# EAGLE design v1 (EAGLE 8.5.1)
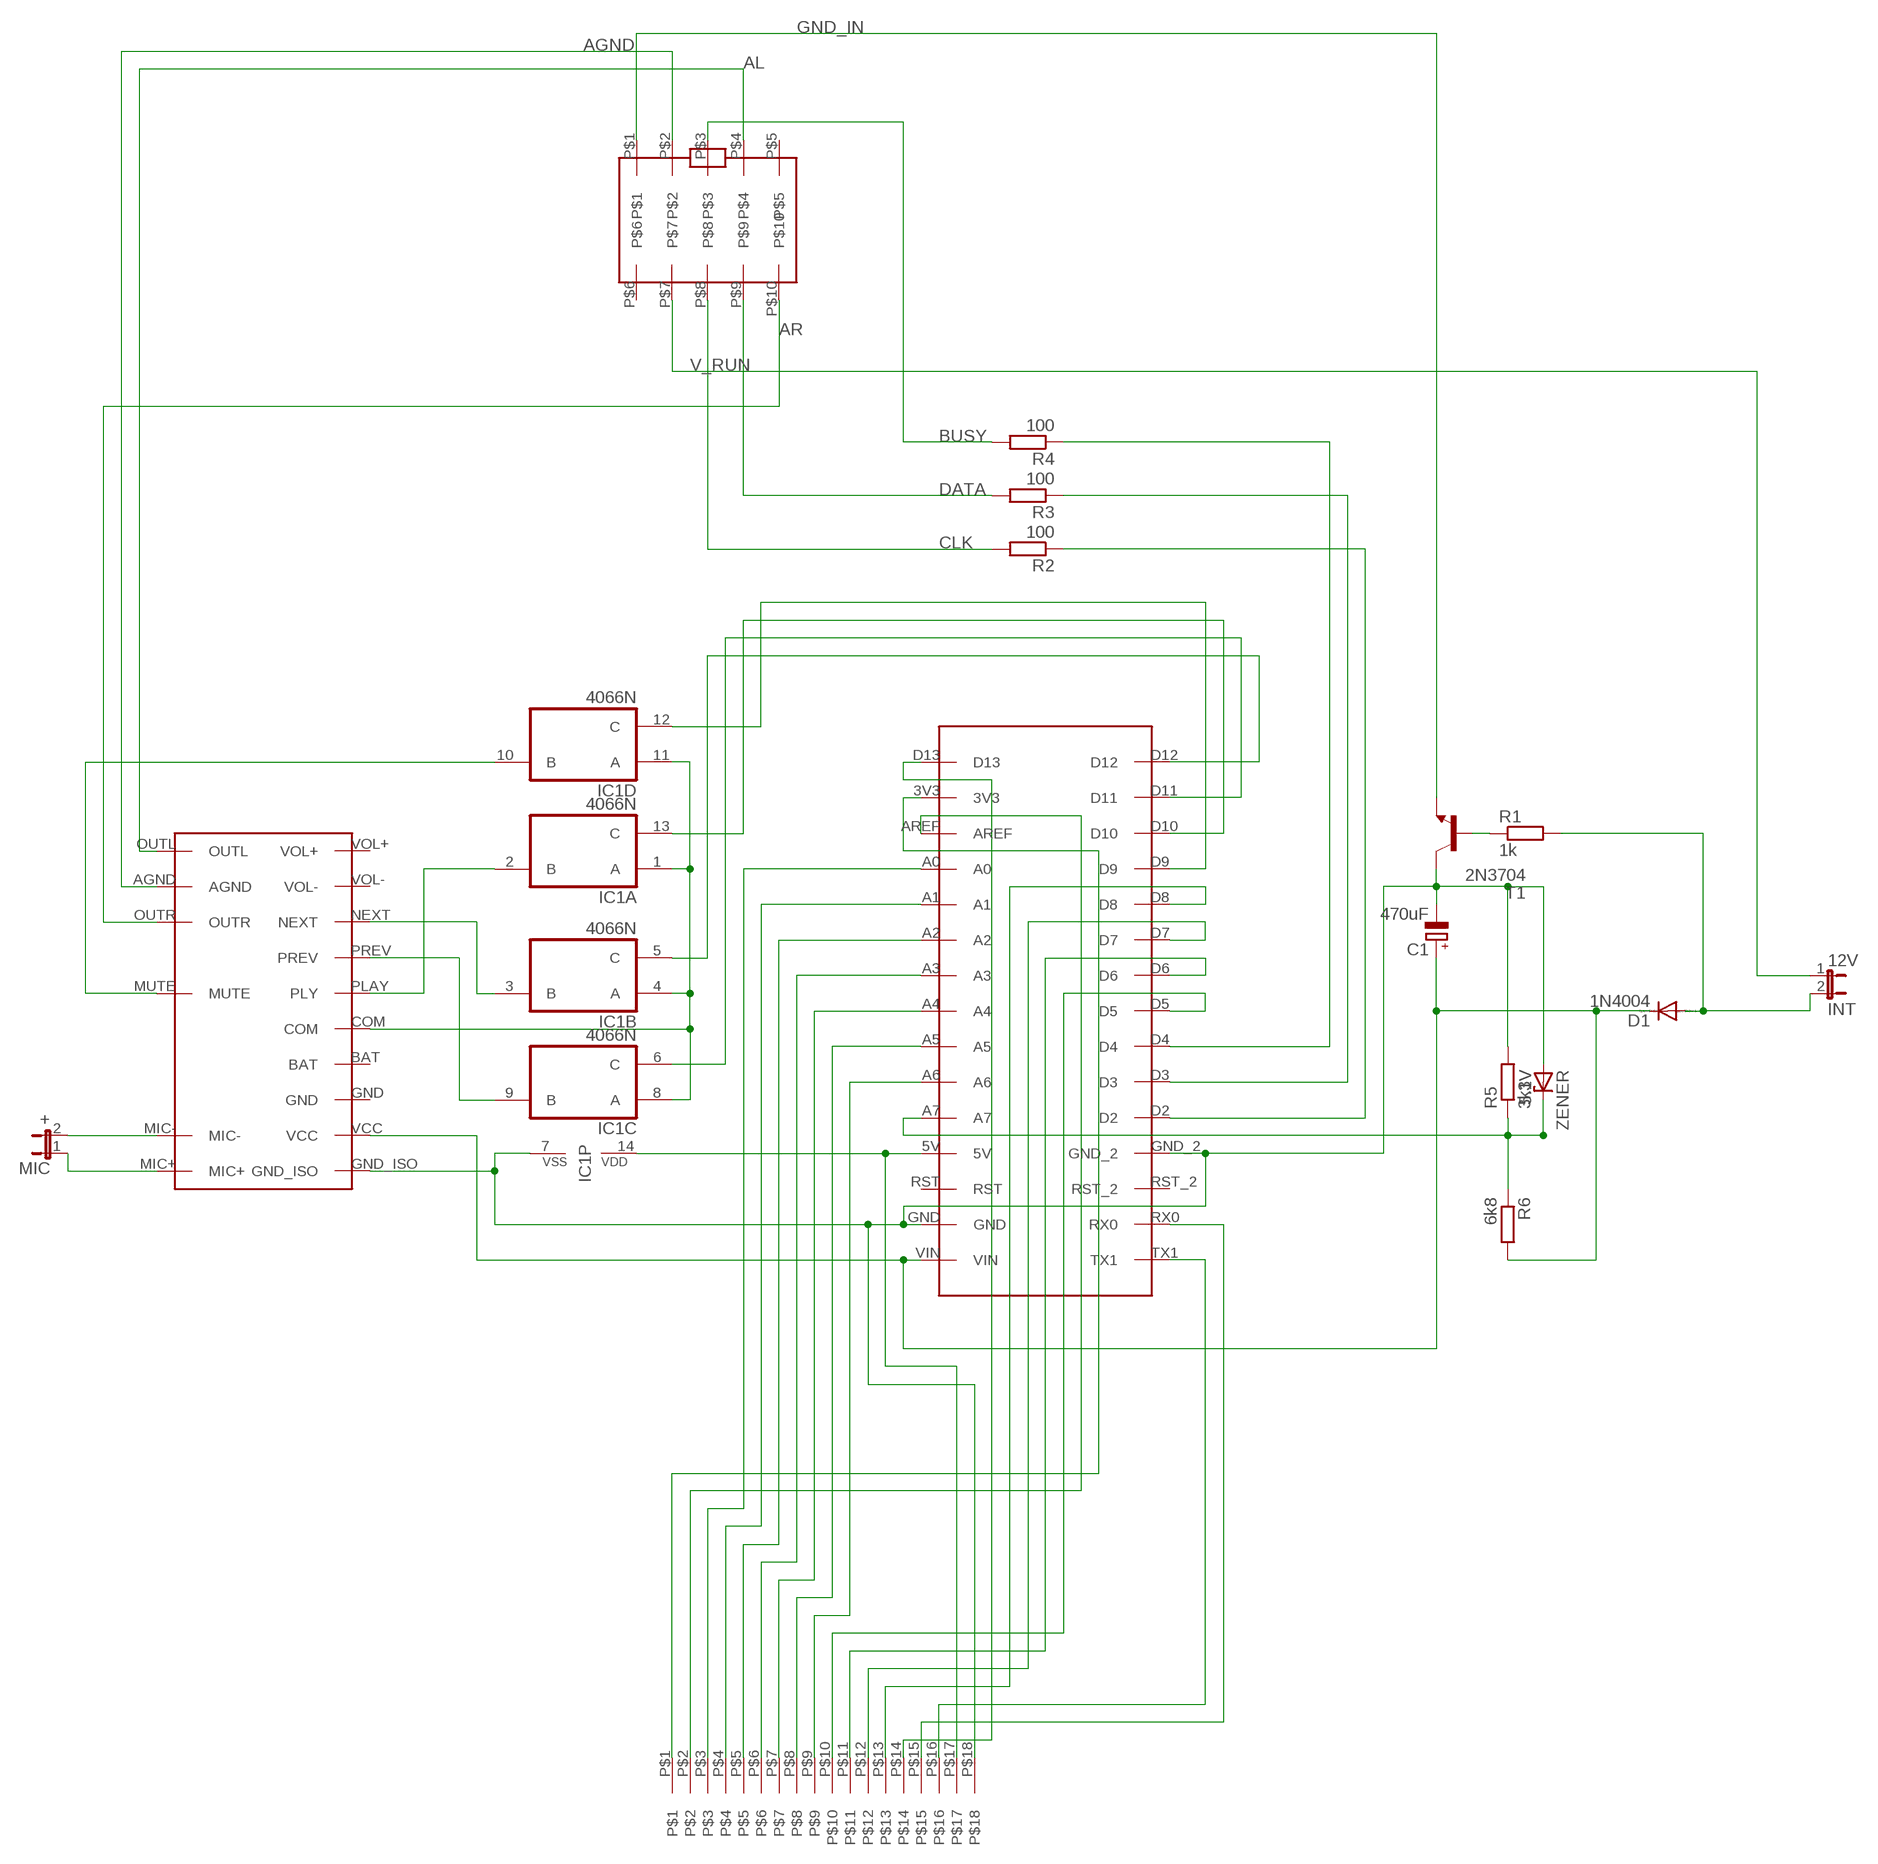
[diagram p0: schematic, sheet 1]

## Parts
12V  INT  JP1E  [JP1]
C1  470uF  CPOL-EUE3.5-8  [E3,5-8]
D1  1N4004  [DO41-10]
IC1  4066N  [DIL14]
MIC  +  JP1E  [JP1]
R1  1k  R-EU_0207/10  [0207/10]
R2  100  R-EU_0207/10  [0207/10]
R3  100  R-EU_0207/10  [0207/10]
R4  100  R-EU_0207/10  [0207/10]
R5  3k3  R-EU_0207/10  [0207/10]
R6  6k8  R-EU_0207/10  [0207/10]
T1  2N3704  [TO92]
U$1  JMP18X1  [JMP18X1]
U$2  CSR8645_MODULE  [CSR8645_MODULE]
U$4  2X5_PIN_SOCKET  [2X5_PIN_SOCKET]
U$5  ARDUINO_NANO  [ARDUINO_NANO]
ZENER  5.1V  ZENER-DIODEDO41Z10  [DO41Z10]

## Nets
12V: 12V.2 D1.A R1.2
AGND: U$2.AGND U$4.P$2
AL: U$2.OUTL U$4.P$4
AR: U$2.OUTR U$4.P$10
BUSY: R4.2 U$4.P$3
CLK: R2.2 U$4.P$8
DATA: R3.2 U$4.P$9
GND: C1.- IC1.7(P:VSS) R5.2 T1.2(C) U$1.P$18 U$2.GND_ISO U$5.GND U$5.GND_2 ZENER.A
GND_IN: T1.3(E) U$4.P$1
N$1: IC1.5(B:C) U$5.D12
N$2: IC1.6(C:C) U$5.D11
N$3: IC1.13(A:C) U$5.D10
N$4: IC1.12(D:C) U$5.D9
N$5: U$1.P$16 U$5.TX1
N$6: IC1.1(A:A) IC1.4(B:A) IC1.8(C:A) IC1.11(D:A) U$2.COM
N$7: R1.1 T1.1(B)
N$8: R5.1 R6.1 U$5.A7 ZENER.C
N$9: IC1.2(A:B) U$2.PLAY(PLY)
N$10: U$1.P$15 U$5.RX0
N$11: IC1.9(C:B) U$2.PREV
N$12: IC1.3(B:B) U$2.NEXT
N$13: R2.1 U$5.D2
N$14: IC1.14(P:VDD) U$1.P$17 U$5.5V
N$15: IC1.10(D:B) U$2.MUTE
N$16: R3.1 U$5.D3
N$17: R4.1 U$5.D4
N$18: U$1.P$14 U$5.D13
N$19: U$1.P$13 U$5.D8
N$20: U$1.P$12 U$5.D7
N$21: U$1.P$11 U$5.D6
N$22: U$1.P$10 U$5.D5
N$23: U$1.P$9 U$5.A6
N$24: U$1.P$8 U$5.A5
N$25: U$1.P$7 U$5.A4
N$26: U$1.P$6 U$5.A3
N$27: U$1.P$5 U$5.A2
N$28: U$1.P$4 U$5.A1
N$29: U$1.P$3 U$5.A0
N$30: U$1.P$2 U$5.AREF
N$31: U$1.P$1 U$5.3V3
N$32: MIC.1 U$2.MIC+
N$33: MIC.2 U$2.MIC-
V_RUN: 12V.1 U$4.P$7
VCC: C1.+ D1.C R6.2 U$2.VCC U$5.VIN
Unconnected: U$2.BAT U$2.GND U$2.VOL+ U$2.VOL- U$4.P$5 U$4.P$6 U$5.RST U$5.RST_2

## Library data of the parts
12V MIC = jumper:JP1E: JUMPER
C1 = rcl:CPOL-EU: POLARIZED CAPACITOR, European symbol; SPICEPREFIX: C
D1 = diode:1N4004: DIODE general purpose rectifier, 1 A
IC1 = 40xx:4066: Quad bilateral ANALOG SWITCH
R1-R6 = rcl:R-EU_: RESISTOR, European symbol; SPICEPREFIX: R
T1 = transistor:2N3704: NPN TRANSISTOR
U$1 = archi_laptop:JMP18X1
U$2 = archi_laptop:CSR8645_MODULE
U$4 = archi_laptop:2X5_PIN_SOCKET
U$5 = archi_laptop:ARDUINO_NANO
ZENER = diode:ZENER-DIODE: Z-Diode

## Board
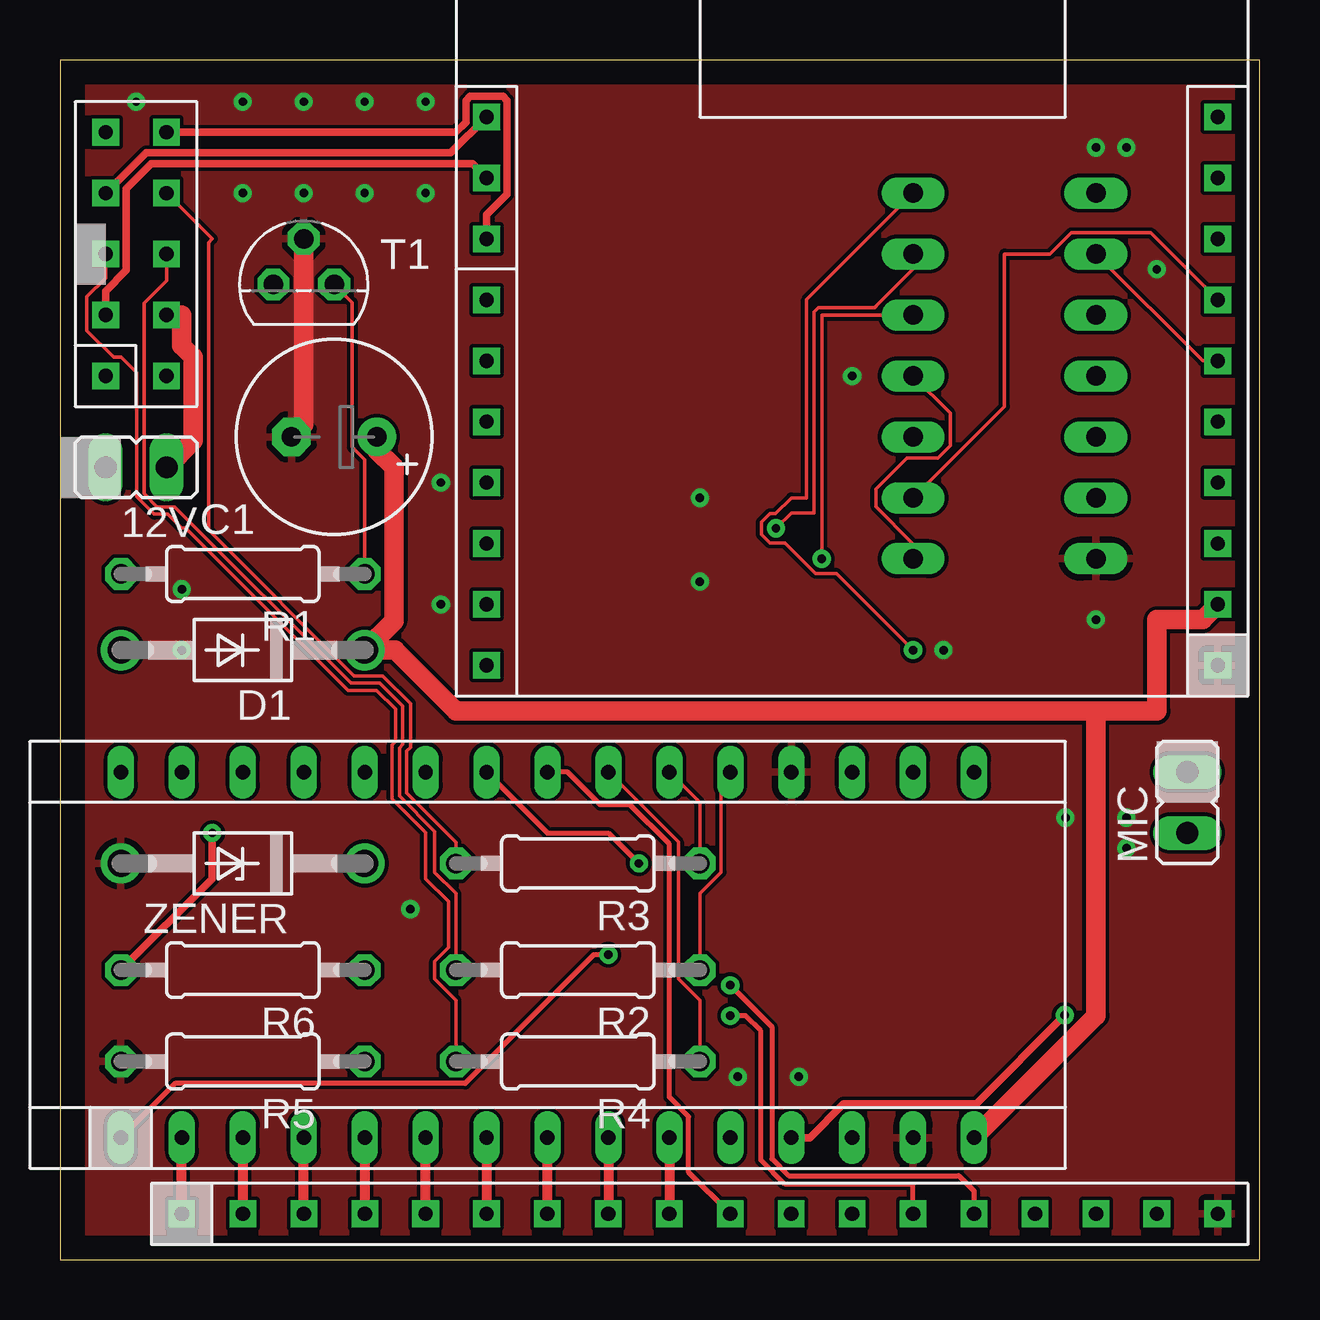
[diagram p1: board, top side]
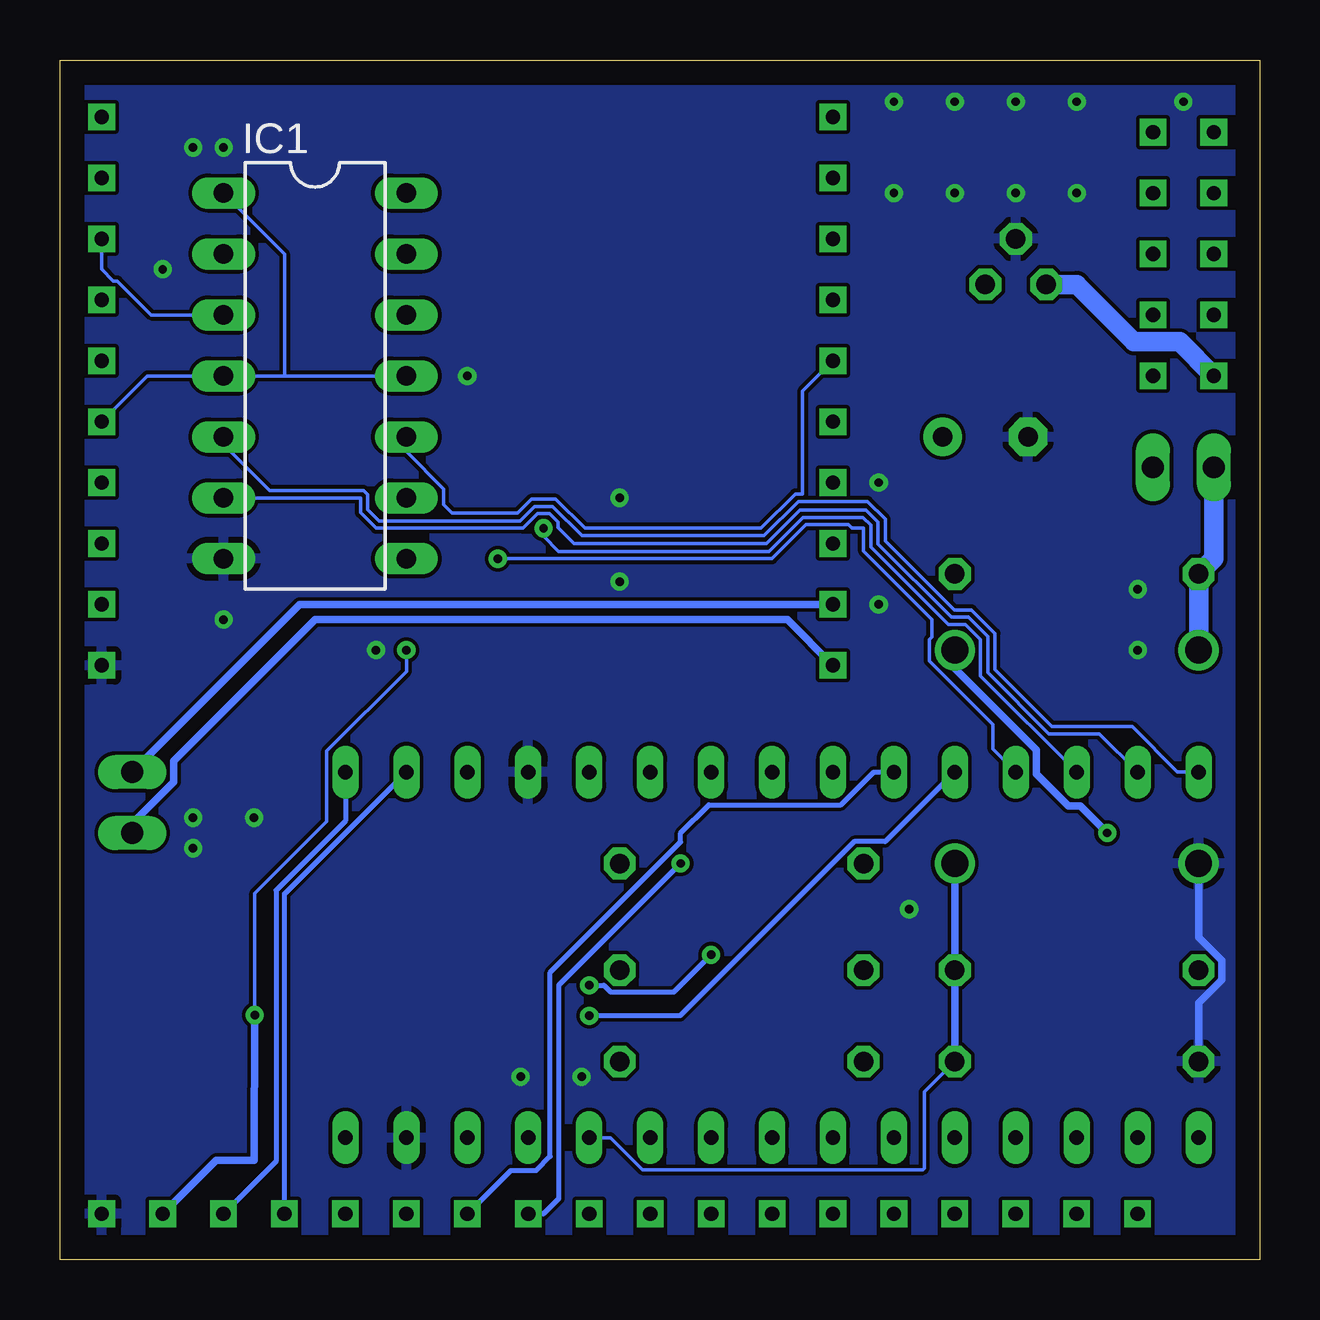
[diagram p2: board, bottom side, seen from below]

Size 50 x 50 mm. Coordinates in mm from the lower left corner, seen from the top.
Outline: 0,0 50,0 50,50 0,50 0,0
Copper layers (1*16): Top 0.035mm / dielectric 1.5mm / Bottom 0.035mm
Design rules "default *": minimum track width 6mil, minimum drill 0.35mm, track to track 6mil, track to pad 6mil, pad to pad 6mil, via to via 6mil, smd to smd 6mil, copper to edge 40mil, drill to drill 6mil, minimum pad ring 10mil, minimum via ring 8mil, stop-mask expansion 4mil, vias tented up to drill 0mil, thermal gap 10mil

### Footprints (pad centres in the part's own frame; a part is rotated, then mirrored left to right if it is on the bottom)
JP1 = drill 0.914 long: 1 0,-1.27; 2 0,1.27
E3,5-8 = drill 0.813 pad 1.6: + -1.778,0 | drill 0.813 pad 1.6 octagon: - 1.778,0
DO41-10 = drill 1.118: A 5.08,0; C -5.08,0
DIL14 = drill 0.813 long: 1 -7.62,-3.81; 2 -5.08,-3.81; 3 -2.54,-3.81; 4 0,-3.81; 5 2.54,-3.81; 6 5.08,-3.81; 7 7.62,-3.81; 8 7.62,3.81; 9 5.08,3.81; 10 2.54,3.81; 11 0,3.81; 12 -2.54,3.81; 13 -5.08,3.81; 14 -7.62,3.81
0207/10 = drill 0.813 octagon: 1 -5.08,0; 2 5.08,0
TO92 = drill 0.813 octagon: 1 1.27,0; 2 0,1.905; 3 -1.27,0
JMP18X1 = drill 0.6 square: P$1 0,12.7; P$2 0,10.16; P$3 0,7.62; P$4 0,5.08; P$5 0,2.54; P$6 0,0; P$7 0,-2.54; P$8 0,-5.08; P$9 0,-7.62; P$10 0,-10.16; P$11 0,-12.7; P$12 0,-15.24; P$13 0,-17.78; P$14 0,-20.32; P$15 0,-22.86; P$16 0,-25.4; P$17 0,-27.94; P$18 0,-30.48
CSR8645_MODULE = drill 0.6 square: AGND -15.24,5.08; BAT 15.24,-7.62; COM 15.24,-5.08; GND 15.24,-10.16; GND_ISO 15.24,-15.24; MIC+ -15.24,-15.24; MIC- -15.24,-12.7; MUTE -15.24,-2.54; NEXT 15.24,2.54; OUTL -15.24,7.62; OUTR -15.24,2.54; P$1 -15.24,0; P$2 -15.24,-5.08; P$3 -15.24,-7.62; P$4 -15.24,-10.16; PLAY 15.24,-2.54; PREV 15.24,0; VCC 15.24,-12.7; VOL+ 15.24,7.62; VOL- 15.24,5.08
2X5_PIN_SOCKET = drill 0.6 square: P$1 -5.08,2.54; P$2 -2.54,2.54; P$3 0,2.54; P$4 2.54,2.54; P$5 5.08,2.54; P$6 -5.08,0; P$7 -2.54,0; P$8 0,0; P$9 2.54,0; P$10 5.08,0
ARDUINO_NANO = drill 0.6 long: 3V3 -7.62,12.7; 5V -7.62,-12.7; A0 -7.62,7.62; A1 -7.62,5.08; A2 -7.62,2.54; A3 -7.62,0; A4 -7.62,-2.54; A5 -7.62,-5.08; A6 -7.62,-7.62; A7 -7.62,-10.16; AREF -7.62,10.16; D2 7.62,-10.16; D3 7.62,-7.62; D4 7.62,-5.08; D5 7.62,-2.54; D6 7.62,0; D7 7.62,2.54; D8 7.62,5.08; D9 7.62,7.62; D10 7.62,10.16; D11 7.62,12.7; D12 7.62,15.24; D13 -7.62,15.24; GND -7.62,-17.78; GND_2 7.62,-12.7; RST -7.62,-15.24; RST_2 7.62,-15.24; RX0 7.62,-17.78; TX1 7.62,-20.32; VIN -7.62,-20.32
DO41Z10 = drill 1.118: A 5.08,0; C -5.08,0

### Placement (x,y rotation side)
12V  3.17,33.02 90 top
C1  11.43,34.29 180 top
D1  7.62,25.4 180 top
IC1  39.37,36.83 270 bottom
MIC  46.99,19.05 0 top
R1  7.62,28.57 180 top
R2  21.59,12.06 180 top
R3  21.59,16.51 180 top
R4  21.59,8.26 180 top
R5  7.62,8.26 180 top
R6  7.62,12.06 180 top
T1  10.16,40.64 0 top
U$1  17.78,1.91 90 top
U$2  33.02,40.01 0 top
U$4  4.45,41.91 90 top
U$5  17.78,12.7 90 top
ZENER  7.62,16.51 180 top

### Tracks (layer width: path | path; a pad name or v marks a point on that pad's centre or on a via)
12V
  Bottom 0.813: 12V.2 1.91,29.21 R1.2 D1.A
AGND
  Top 0.305: U$4.P$2 1.91,40.37 2.76,41.23 2.76,44.63 3.81,45.67 17.19,45.67 U$2.AGND
AL
  Top 0.305: U$4.P$4 3.59,46.13 16.29,46.13 U$2.OUTL
AR
  Top 0.305: 5.34,46.99 U$4.P$10 16.5,46.99 16.92,47.41 16.92,48.3 17.1,48.48 18.46,48.48 18.64,48.3 18.64,44.41 17.78,43.55 U$2.OUTR
BUSY
  Top 0.152: U$4.P$3 1.91,40.91 1.12,40.13 1.12,38.72 2.23,37.61 2.55,37.61 3.2,36.97 3.2,31.79 3.93,31.06 4.5,31.06 5.08,30.48 5.25,30.48 12.01,23.72 13.2,23.72 13.98,22.94 13.98,21.59 13.85,21.45 13.85,19.19 15.24,17.8 15.24,15.88 16.19,14.92 16.19,13.01 15.62,12.43 15.62,11.7 16.51,10.81 R4.2
CLK
  Top 0.152: U$4.P$8 4.45,40.8 3.5,39.86 3.5,31.92 4.06,31.37 4.79,31.37 12.13,24.03 13.32,24.03 14.29,23.06 14.29,21.46 14.15,21.32 14.15,19.32 15.62,17.85 15.62,16.14 16.51,15.25 R2.2
DATA
  Top 0.152: U$4.P$9 6.35,42.55 6.19,42.39 6.19,30.4 12.26,24.33 13.45,24.33 14.61,23.18 14.61,21.35 14.46,21.2 14.46,19.44 16.51,17.39 R3.2
GND  (via drill 0.35)
  Top 0.813: C1.- 10.16,34.8 T1.2
  Bottom 0.305: R5.2 2.54,10.7 1.57,11.66 1.57,12.46 2.54,13.43 ZENER.A
  other vias: 7.62,48.26 10.16,48.26 7.62,44.45 10.16,44.45 12.7,44.45 15.24,44.45 12.7,48.26 15.24,48.26 3.17,48.26 15.88,27.3 28.26,7.62 14.61,14.61 30.8,7.62 43.18,46.35 44.45,46.35 41.91,18.41 45.72,41.27 44.45,18.41 44.45,17.14 26.67,28.26 15.88,32.38 33.02,36.83 36.83,25.4 26.67,31.75 43.18,26.67 5.08,25.4 5.08,27.94
  pour Bottom: -1.27,52.07 50.8,50.8 50.8,-1.27 -1.27,-1.27
  pour Top: -2.54,52.7 54.61,52.7 55.88,-2.54 54.61,-3.81 -3.81,-3.81 -5.08,-2.54 -5.08,52.07
GND_IN
  Bottom 0.813: U$4.P$1 3.33,38.26 5.23,38.26 7.61,40.64 T1.3
N$1
  Bottom 0.152: IC1.5 43.18,33.97 41.26,32.05 37.35,32.05 37.17,31.88 37.17,31.25 36.7,30.79 30.83,30.79 30.22,31.39 29.47,31.39 28.25,30.17 20.65,30.17 19.22,31.6 16.34,31.6 15.6,30.86 15.6,29.95 12.72,27.08 12.01,27.08 11.02,26.09 11.02,24.59 8.65,22.21 5.31,22.21 3.42,20.32 U$5.D12
N$2
  Bottom 0.152: IC1.6 37.48,31.75 37.48,31.13 36.83,30.48 30.7,30.48 30.1,31.09 29.59,31.09 29.24,30.73 29.24,30.51 28.57,29.84 20.55,29.84 19.16,31.24 16.41,31.24 15.9,30.73 15.9,29.83 12.84,26.77 12.13,26.77 11.33,25.97 11.33,24.46 8.78,21.91 6.67,21.91 U$5.D11
N$3  (via drill 0.35)
  Top 0.152: v29.84,30.48 30.48,31.11 31.43,31.11 31.43,39.48 31.62,39.67 33.96,39.67 34.01,39.73 34.01,39.74 35.56,41.29 IC1.13
  Bottom 0.152: U$5.D10 11.63,24.33 11.63,25.84 12.26,26.47 12.97,26.47 16.2,29.7 16.2,30.61 16.53,30.93 19.03,30.93 20.45,29.52 29.21,29.52 29.84,30.15 v29.84,30.48
N$4  (via drill 0.35)
  Top 0.152: v31.75,29.21 31.75,39.37 IC1.12
  Bottom 0.152: v31.75,29.21 20.32,29.21 18.9,30.63 17.13,30.63 16.98,30.48 16.51,30.48 16.51,29.53 13.65,26.67 13.65,25.96 13.77,25.84 13.77,24.96 11.11,22.3 11.11,21.27 U$5.D9
N$5
  Bottom 0.203: U$5.TX1 38.1,18.28 41,15.39 41,4.09 U$1.P$16
N$6
  Top 0.152: IC1.8 35.56,29.83 34.01,31.38 34.01,32.12 35.29,33.4 36.59,33.4 37.11,33.92 37.11,35.28 IC1.11
  Bottom 0.152: IC1.11 40.64,36.83 | 40.64,36.83 IC1.4 46.35,36.83 U$2.COM | IC1.1 40.64,41.91 40.64,36.83
N$7
  Top 0.152: R1.1 12.7,33.34 12.18,33.86 12.18,39.89 T1.1
N$8
  Bottom 0.152: R5.1 13.97,6.99 13.97,3.81 14.04,3.74 25.72,3.74 27.06,5.08 U$5.A7
  Bottom 0.305: ZENER.C R6.1 R5.1
N$9
  Top 0.152: IC1.2 47.62,37.47 U$2.PLAY
N$10
  Bottom 0.203: U$1.P$15 40.64,15.24 U$5.RX0
N$11
  Top 0.152: IC1.9 39.37,35.56 39.37,41.91 41.26,41.91 42.15,42.8 45.47,42.8 U$2.PREV
N$12
  Bottom 0.152: U$2.NEXT 48.26,41.27 47.77,40.79 47.61,40.79 46.19,39.37 IC1.3
N$13
  Top 0.152: R2.1 26.67,15.25 27.56,16.14 27.56,19.94 U$5.D2
N$14  (via drill 0.35)
  Top 0.152: v35.56,25.4 32.36,28.6 31.5,28.6 30.23,29.87 29.59,29.87 29.24,30.23 29.24,30.73 29.59,31.09 29.82,31.09 30.48,31.75 31.11,31.75 31.11,40.01 IC1.14
  Top 0.305: U$5.5V 31.25,5.08 32.66,6.49 38.19,6.49 v41.88,10.19
  Bottom 0.152: v41.88,10.19 41.88,15.27 38.88,18.27 38.88,21.2 35.56,24.52 v35.56,25.4
  Bottom 0.305: v41.88,10.19 41.91,4.13 43.5,4.13 U$1.P$17
N$15
  Bottom 0.152: U$2.MUTE 19.05,36.2 19.05,31.91 19.35,31.91 20.77,30.48 28.12,30.48 29.34,31.7 30.35,31.7 30.93,31.11 33.66,31.11 34.01,31.47 34.01,32.12 35.56,33.67 IC1.10
N$16
  Top 0.152: R3.1 26.67,19.05 U$5.D3
N$17
  Top 0.152: R4.1 26.67,10.81 25.78,11.7 25.78,17.4 U$5.D4
N$18  (via drill 0.35)
  Top 0.203: v22.86,12.7 22.25,12.7 16.89,7.34 4.8,7.34 U$5.D13 | v27.94,11.43 29.67,9.7 29.67,4.19 30.37,3.49 37.47,3.49 38.1,2.86 U$1.P$14
  Bottom 0.203: v27.94,11.43 27.33,11.43 27.05,11.15 24.41,11.15 v22.86,12.7
N$19  (via drill 0.35)
  Top 0.203: U$1.P$13 35.56,3.14 30.22,3.14 29.21,4.15 29.21,9.53 28.57,10.16 v27.94,10.16
  Bottom 0.203: U$5.D8 15.6,17.42 16.89,17.42 24.15,10.16 v27.94,10.16
N$20
  Bottom 0.203: U$1.P$12 31.21,3.72 30.14,3.72 29.57,4.3 29.57,11.97 24.13,17.4 24.13,17.78 22.95,18.96 17.45,18.96 16.08,20.32 U$5.D7
N$21  (via drill 0.35)
  Top 0.203: U$5.D6 20.32,17.78 22.86,17.78 v24.13,16.51
  Bottom 0.203: v24.13,16.51 29.21,11.43 29.21,2.54 29.84,1.91 U$1.P$11
N$22
  Top 0.203: U$1.P$10 26.21,3.64 26.21,5.97 25.4,6.78 25.4,17.31 23.75,18.96 22.52,18.96 21.16,20.32 U$5.D5
N$23
  Top 0.406: U$5.A6 U$1.P$9
N$24
  Top 0.406: U$5.A5 U$1.P$8
N$25
  Top 0.406: U$1.P$7 U$5.A4
N$26
  Top 0.406: U$5.A3 U$1.P$6
N$27
  Top 0.406: U$1.P$5 U$5.A2
N$28
  Top 0.406: U$5.A1 U$1.P$4
N$29
  Top 0.406: U$1.P$3 U$5.A0
N$30
  Top 0.406: U$5.AREF U$1.P$2
N$31
  Top 0.406: U$1.P$1 U$5.3V3
N$32
  Bottom 0.305: U$2.MIC+ 19.68,26.67 39.37,26.67 45.26,20.78 45.26,19.9 46.99,18.17 MIC.1
N$33
  Bottom 0.305: U$2.MIC- 40.01,27.3 MIC.2
V_RUN
  Top 0.813: 12V.1 5.56,34.13 5.56,37.62 5.08,38.09 5.08,39.37 U$4.P$7
VCC  (via drill 0.35)
  Top 0.305: R6.2 6.35,15.88 v6.35,17.78
  Top 0.813: C1.+ 13.21,33.73 13.92,33.02 13.92,26.62 D1.C 13.97,25.4 16.51,22.86 43.18,22.86 | 43.18,22.86 45.72,22.86 45.72,26.67 47.62,26.67 U$2.VCC | U$5.VIN 43.18,10.16 43.18,22.86
  Bottom 0.305: v6.35,17.78 7.48,18.91 7.98,18.91 9.3,20.23 9.3,21.23 12.7,24.63 D1.C